# EAGLE schematic receiver (EAGLE 9.2.0)
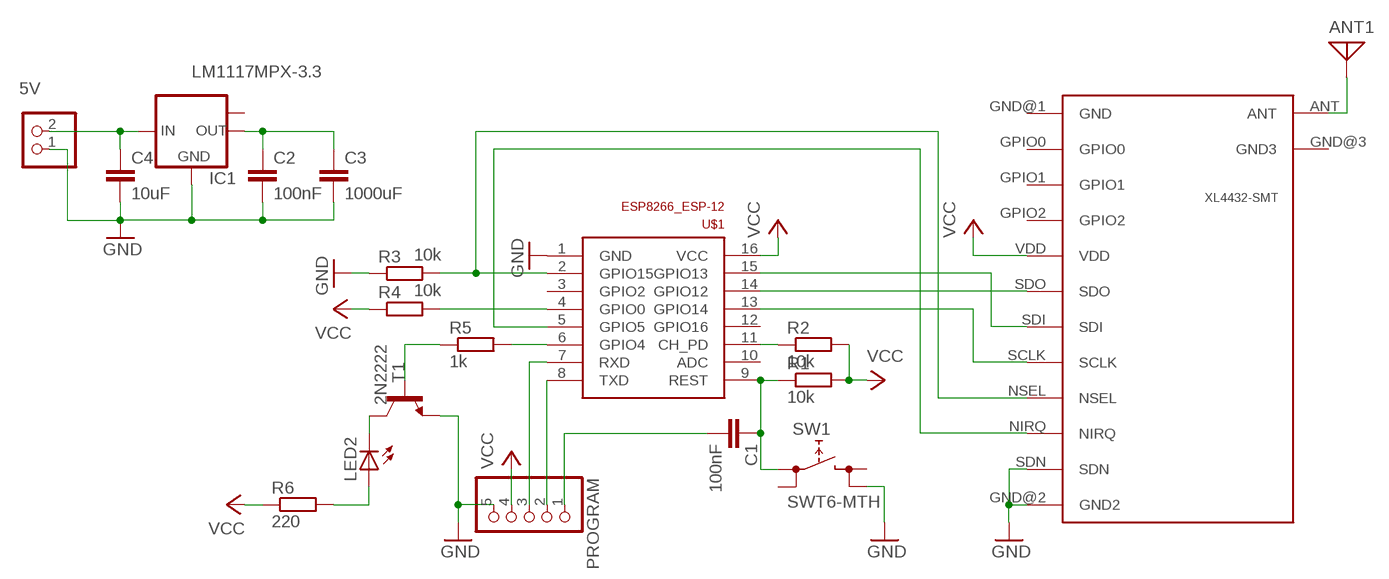
[diagram p0: schematic, sheet 1]

## Parts
5V  PINHD-1X2  [1X02]
4332-1  XM4432-SMT  [XL4432-SMT]
ANT1  ANTENNA  [PAD-01]
C1  100nF  C-EUC0402  [C0402]
C2  100nF  C-EUC0402  [C0402]
C3  1000uF  C-EU025-024X044  [C025-024X044]
C4  10uF  C-EU025-024X044  [C025-024X044]
IC1  LM1117MPX-3.3  [SOT223]
LED2  LEDCHIP-LED0805  [CHIP-LED0805]
PROGRAM  PINHD-1X5  [1X05]
R1  10k  R-EU_R0402  [R0402]
R2  10k  R-EU_R0402  [R0402]
R3  10k  R-EU_R0402  [R0402]
R4  10k  R-EU_R0402  [R0402]
R5  1k  R-EU_R0402  [R0402]
R6  220  R-EU_R0402  [R0402]
SW1  SWT6-MTH  [SWT6_M_TH]
T1  2N2222  [TO18]
U$1  ESP8266_ESP-12  [ESP8266-ESP12]

## Nets
GND: 5V.1 4332-1.GND@2(GND2) 4332-1.SDN C2.2 C3.2 C4.2 IC1.1(GND) PROGRAM.5 R3.1 SW1.P4 T1.1(E) U$1.1(GND)
N$1: C1.1 R1.1 SW1.P1 U$1.9(REST)
N$2: C1.2 PROGRAM.1
N$3: PROGRAM.2 U$1.8(TXD)
N$4: PROGRAM.3 U$1.7(RXD)
N$5: R4.2 U$1.4(GPIO0)
N$6: 4332-1.NSEL R3.2 U$1.2(GPIO15)
N$7: R2.1 U$1.11(CH_PD)
N$8: 4332-1.SDO U$1.14(GPIO12)
N$9: 4332-1.SDI U$1.15(GPIO13)
N$10: 4332-1.SCLK U$1.13(GPIO14)
N$11: 4332-1.NIRQ U$1.5(GPIO5)
N$12: 4332-1.ANT ANT1.1
N$13: R5.2 U$1.6(GPIO4)
N$14: R5.1 T1.2(B)
N$15: LED2.C T1.3(C)
N$16: LED2.A R6.2
N$17: 5V.2 C4.1 IC1.3(IN)
N$18: C2.1 C3.1 IC1.2(OUT)
VCC: 4332-1.VDD PROGRAM.4 R1.2 R2.2 R4.1 R6.1 U$1.16(VCC)
Unconnected: 4332-1.GPIO0 4332-1.GPIO1 4332-1.GPIO2 IC1.TAB(OUT1) SW1.P2 SW1.P3 U$1.3(GPIO2) U$1.10(ADC) U$1.12(GPIO16)

## Power pins joined to a net without a drawn wire
GND: 4332-1.GND@1(GND)
GND3: 4332-1.GND@3(GND3)

## Library data of the parts
5V = pinhead:PINHD-1X2: PIN HEADER
4332-1 = xl4432-smt:XM4432-SMT: XL4432-SMT Si4432 based transceiver Drawn by Will Cooke. Made available under the GPL. For full licence details please see the github page or read any copy of the GPL v2. Datasheet available here:http://www.silabs.com/Support%20Documents/TechnicalDocs/Si4430-31-32.pdf www.whizzy.org https://github.com/8none1 @8none1 <https://twitter.com/8none1>
ANT1 = discrete:ANTENNA: Antenna
C1-C4 = rcl:C-EU: CAPACITOR, European symbol; SPICEPREFIX: C
IC1 = lm1117:LM1117MPX-*
LED2 = led:LED: LED OSRAM: - CHIPLED LG R971, LG N971, LY N971, LG Q971, LY Q971, LO R971, LY R971 LH N974, LH R974 LS Q976, LO Q976, LY Q976 LO Q996 - Hyper CHIPLED LW Q18S LB Q993, LB Q99A, LB R99A - SideLED LS A670, LO A670, LY A670, LG A670, LP A670 LB A673, LV A673, LT A673, LW A673 LH A674 LY A675 LS A676, LA A676, LO A676, LY A676, LW A676 LS A679, LY A679, LG A679 - Hyper Micro SIDELED® LS Y876, LA Y876, LO Y876, LY Y876 LT Y87S - SmartLED LW L88C, LW L88S LB L89C, LB L89S, LG L890 LS L89K, LO L89K, LY L89K LS L896, LA L896, LO L896, LY L896 - TOPLED LS T670, LO T670, LY T670, LG T670, LP T670 LSG T670, LSP T670, LSY T670, LOP T670, LYG T670 LG T671, LOG T671, LSG T671 LB T673, LV T673, LT T673, LW T673 LH T674 LS T676, LA T676, LO T676, LY T676, LB T676, LH T676, LSB T676, LW T676 LB T67C, LV T67C, LT T67C, LS T67K, LO T67K, LY T67K, LW E67C LS E67B, LA E67B, LO E67B, LY E67B, LB E67C, LV E67C, LT E67C LW T67C LS T679, LY T679, LG T679 LS T770, LO T770, LY T770, LG T770, LP T770 LB T773, LV T773, LT T773, LW T773 LH T774 LS E675, LA E675, LY E675, LS T675 LS T776, LA T776, LO T776, LY T776, LB T776 LHGB T686 LT T68C, LB T68C - Hyper Mini TOPLED® LB M676 - Mini TOPLED Santana® LG M470 LS M47K, LO M47K, LY M47K Source: http://www.osram.convergy.de LUXEON: - LUMILED® LXK2-PW12-R00, LXK2-PW12-S00, LXK2-PW14-U00, LXK2-PW14-V00 LXK2-PM12-R00, LXK2-PM12-S00, LXK2-PM14-U00 LXK2-PE12-Q00, LXK2-PE12-R00, LXK2-PE12-S00, LXK2-PE14-T00, LXK2-PE14-U00 LXK2-PB12-K00, LXK2-PB12-L00, LXK2-PB12-M00, LXK2-PB14-N00, LXK2-PB14-P00, LXK2-PB14-Q00 LXK2-PR12-L00, LXK2-PR12-M00, LXK2-PR14-Q00, LXK2-PR14-R00 LXK2-PD12-Q00, LXK2-PD12-R00, LXK2-PD12-S00 LXK2-PH12-R00, LXK2-PH12-S00 LXK2-PL12-P00, LXK2-PL12-Q00, LXK2-PL12-R00 Source: www.luxeon.com KINGBRIGHT: KA-3528ASYC Source: www.kingbright.com
PROGRAM = pinhead:PINHD-1X5: PIN HEADER
R1-R6 = rcl:R-EU_: RESISTOR, European symbol; SPICEPREFIX: R
SW1 = tactile_switch:SWT6-M
T1 = transistor:2N2222: NPN TRANSISTOR
U$1 = ESP8266-ESP12:ESP8266_ESP-12